# Altium schematic sheet Side_PCB.SchDoc
size A4
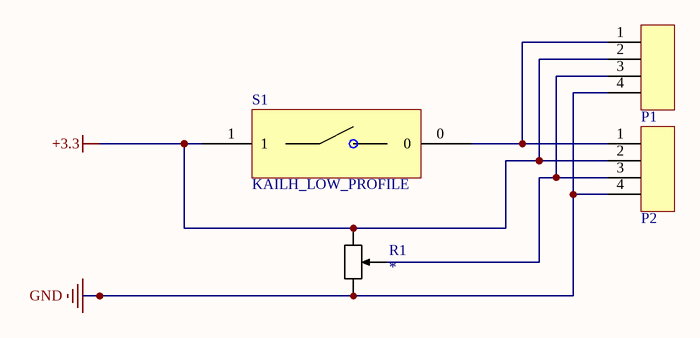
[diagram p0: Side_PCB.SchDoc]

## Parts
P1  JST_SE_4PIN  [JST_SE_4PIN]  (value not drawn)
P2  JST_SE_4PIN  [JST_SE_4PIN]  (value not drawn)
R1  R_POTMETER  (value not drawn)
S1  KAILH_LOW_PROFILE  [KAILH_LOW_PROFILE]

## Nets
+3.3: P1.2 P2.2 R1.1 S1.1
GND: P1.4 P2.4 R1.2
NetP1_1: P1.1 P2.1 S1.0
NetP1_3: P1.3 P2.3

## Library data of the parts
P1 P2 = JST_SE_4PIN: Supplier Link 1: *; Supplier Part Number 1: *
R1 = R_POTMETER: Supplier 1: *; Supplier Part Number 1: *; Value: *